# EAGLE schematic Pool Interface (HUZZAH-ESP8266) (EAGLE 7.7.0)
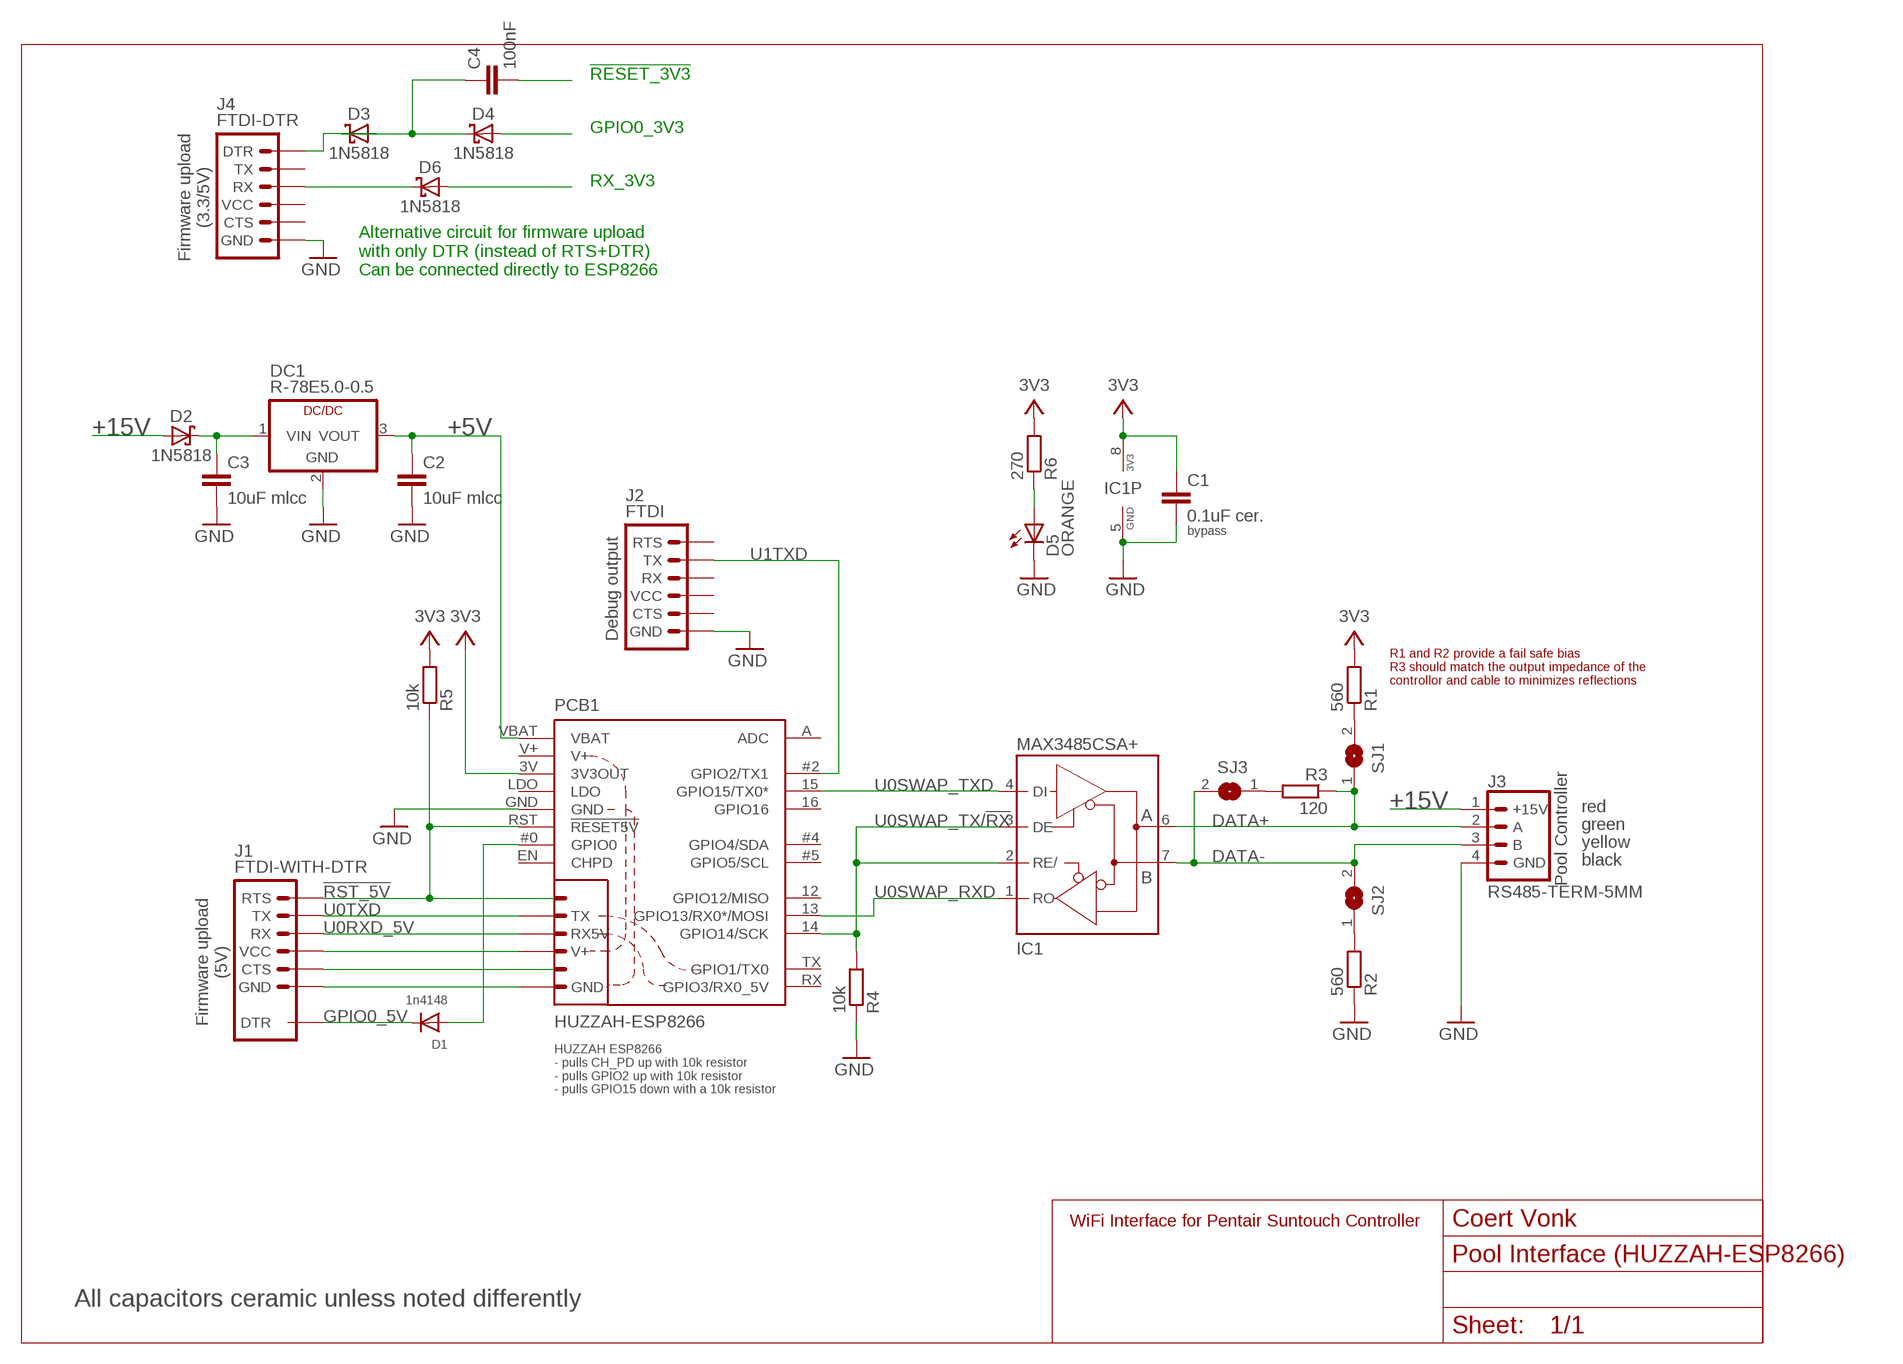
[diagram p0: schematic, sheet 1]
U$1 (FRAME_LETTER_L): AUTHOR_NAME: Coert Vonk; DESCRIPTION: WiFi Interface for Pentair Suntouch Controller; REV: r1.0; URL: http://www.coertvonk.com

## Parts
C1  0.1uF cer.  C-EUC0805K  [C0805K]
C2  10uF mlcc  C-EUC0805K  [C0805K]
C3  10uF mlcc  C-EUC0805K  [C0805K]
C4  100nF  C-EUC0805K  [C0805K]
D1  1n4148  DIODEDO-1N4148  [DO-1N4148]
D2  1N5818  [DO41-7.6]
D3  1N5818  [DO41-7.6]
D4  1N5818  [DO41-7.6]
D5  ORANGE  LEDSML0805  [SML0805]
D6  1N5818  [DO41-7.6]
DC1  R-78E5.0-0.5  [SIP3]
IC1  MAX3485CSA+  [SO08]
J1  FTDI-WITH-DTR  [1X06-DTR]
J2  FTDI  [1X06-DTR]
J3  RS485-TERM-5MM  [RS485-TERM]
J4  FTDI-DTR  [1X06]
PCB1  HUZZAH-ESP8266  [HUZZAH-ESP8266-DUMMY]
R1  560  R-EU_R0805  [R0805]
R2  560  R-EU_R0805  [R0805]
R3  120  R-EU_R0805  [R0805]
R4  10k  R-EU_R0805  [R0805]
R5  10k  R-EU_R0805  [R0805]
R6  270  R-EU_R0805  [R0805]
SJ1  SJ  [SJ]
SJ2  SJ  [SJ]
SJ3  SJ  [SJ]

## Nets
!RST_5V: J1.1(RTS) PCB1.RST(!RESET5V) R5.1
+3V3: C1.1 IC1.8(5V) PCB1.3V(3V3OUT) R1.2 R5.2 R6.2 ; supply symbol labelled 3V3
+5V: C2.1 DC1.3(VOUT) PCB1.VBAT
+15V: C3.1 D2.C DC1.1(VIN) J3.1(+15V)
DATA+: IC1.6(A) J3.2(A) R3.1 SJ1.1
DATA-: IC1.7(B) J3.3(B) SJ2.2 SJ3.2
GND: C1.2 C2.2 C3.2 D5.C DC1.2(GND) IC1.5(GND) J2.6(GND) J3.4(GND) J4.6(GND) PCB1.GND R2.1 R4.1
GPIO0_5V: D1.A PCB1.#0(GPIO0)
N$1: D3.A J4.1(DTR)
N$2: D5.A R6.1
N$3: C4.1 D3.C D4.C
N$4: D6.C J4.3(RX)
N$5: R3.2 SJ3.1
N$6: R2.2 SJ2.1
N$7: R1.1 SJ1.2
N$8: D1.C J1.DTR
N$9: D4.A
N$10: C4.2
N$11: D6.A
N$12: D2.A
N$14: J1.4(VCC) PCB1.V+@2(V+)
N$15: J1.5(CTS)
N$16: J1.6(GND) PCB1.GND@3(GND)
U0RXD_5V: J1.2(RX) PCB1.RX@2(RX5V)
U0SWAP_RXD: IC1.1(RO) PCB1.13(GPIO13/RX0*/MOSI)
U0SWAP_TX/!RX: IC1.2(RE/) IC1.3(DE) PCB1.14(GPIO14/SCK) R4.2
U0SWAP_TXD: IC1.4(DI) PCB1.15(GPIO15/TX0*)
U0TXD: J1.3(TX) PCB1.TX@2(TX)
U1TXD: J2.3(TX) PCB1.#2(GPIO2/TX1)
Unconnected: J2.1(RTS) J2.2(RX) J2.5(CTS) J4.2(TX) J4.5(CTS) PCB1.12(GPIO12/MISO) PCB1.16(GPIO16) PCB1.#4(GPIO4/SDA) PCB1.#5(GPIO5/SCL) PCB1.A(ADC) PCB1.EN(CHPD) PCB1.LDO PCB1.RX(GPIO3/RX0_5V) PCB1.TX(GPIO1/TX0)

## Notes on the sheet
- !RESET_3V3
- GPIO0_3V3
- RX_3V3
- Firmware upload
  (3.3/5V)
- Alternative circuit for firmware upload
  with only DTR (instead of RTS+DTR)
  Can be connected directly to ESP8266
- bypass
- Debug output
- R1 and R2 provide a fail safe bias
  R3 should match the output impedance of the
  controllor and cable to minimizes reflections
- red
- Pool Controller | green
- yellow
- black
- Firmware upload
  (5V)
- HUZZAH ESP8266
  - pulls CH_PD up with 10k resistor
  - pulls GPIO2 up with 10k resistor
  - pulls GPIO15 down with a 10k resistor
- All capacitors ceramic unless noted differently

## Power pins joined to a net without a drawn wire
V+: PCB1.V+
VCC: J2.4(VCC) J4.4(VCC)

## Library data of the parts
C1-C4 = rcl:C-EU: CAPACITOR, European symbol
D1 = adafruit:DIODE: Diode SMADIODE - SMA Surface Mount Package 20V 1A Schottky Diode Digikey: 641-1014-6-ND DO-1N4148 - Through Hole Small Current Diode SOD-123 20V 1 A (.5mV Vf) Schottky Diode - Digikey: MBRX120TPMSCT-ND SOD-323 10V 570mA (.38mV Vf, 3ns) Schottky Diode - Digikey: ZLLS410CT-ND SOD-523 30V 30mA Schottky Diode (RB751S-40TE61) - Digikey: RB751S-40TE61CT-ND SOT23-R/W - SOT23 Package (R = Solder Paste/Reflow Ovens, W = Hand-Soldering) BAT54Film 40V 300mA - Digikey: 497-7162-1-ND
D2-D4 D6 = Coert Vonk:1N581*: 1.0A SCHOTTKY BARRIER RECTIFIER Source: http://www.diodes.com/datasheets/ds23001.pdf
D5 = led:LED: LED OSRAM: - CHIPLED LG R971, LG N971, LY N971, LG Q971, LY Q971, LO R971, LY R971 LH N974, LH R974 LS Q976, LO Q976, LY Q976 LO Q996 - Hyper CHIPLED LW Q18S LB Q993, LB Q99A, LB R99A - SideLED LS A670, LO A670, LY A670, LG A670, LP A670 LB A673, LV A673, LT A673, LW A673 LH A674 LY A675 LS A676, LA A676, LO A676, LY A676, LW A676 LS A679, LY A679, LG A679 - Hyper Micro SIDELED® LS Y876, LA Y876, LO Y876, LY Y876 LT Y87S - SmartLED LW L88C, LW L88S LB L89C, LB L89S, LG L890 LS L89K, LO L89K, LY L89K LS L896, LA L896, LO L896, LY L896 - TOPLED LS T670, LO T670, LY T670, LG T670, LP T670 LSG T670, LSP T670, LSY T670, LOP T670, LYG T670 LG T671, LOG T671, LSG T671 LB T673, LV T673, LT T673, LW T673 LH T674 LS T676, LA T676, LO T676, LY T676, LB T676, LH T676, LSB T676, LW T676 LB T67C, LV T67C, LT T67C, LS T67K, LO T67K, LY T67K, LW E67C LS E67B, LA E67B, LO E67B, LY E67B, LB E67C, LV E67C, LT E67C LW T67C LS T679, LY T679, LG T679 LS T770, LO T770, LY T770, LG T770, LP T770 LB T773, LV T773, LT T773, LW T773 LH T774 LS E675, LA E675, LY E675, LS T675 LS T776, LA T776, LO T776, LY T776, LB T776 LHGB T686 LT T68C, LB T68C - Hyper Mini TOPLED® LB M676 - Mini TOPLED Santana® LG M470 LS M47K, LO M47K, LY M47K Source: http://www.osram.convergy.de LUXEON: - LUMILED® LXK2-PW12-R00, LXK2-PW12-S00, LXK2-PW14-U00, LXK2-PW14-V00 LXK2-PM12-R00, LXK2-PM12-S00, LXK2-PM14-U00 LXK2-PE12-Q00, LXK2-PE12-R00, LXK2-PE12-S00, LXK2-PE14-T00, LXK2-PE14-U00 LXK2-PB12-K00, LXK2-PB12-L00, LXK2-PB12-M00, LXK2-PB14-N00, LXK2-PB14-P00, LXK2-PB14-Q00 LXK2-PR12-L00, LXK2-PR12-M00, LXK2-PR14-Q00, LXK2-PR14-R00 LXK2-PD12-Q00, LXK2-PD12-R00, LXK2-PD12-S00 LXK2-PH12-R00, LXK2-PH12-S00 LXK2-PL12-P00, LXK2-PL12-Q00, LXK2-PL12-R00 Source: www.luxeon.com KINGBRIGHT: KA-3528ASYC Source: www.kingbright.com
DC1 = Coert Vonk:R-78E*-0.5: Recom Power DC/DC-Converter 500 mA SIP3 Single Output Source: Data sheet <http://www.recom-power.com/pdf/Innoline/R-78Exx-0.5.pdf>
IC1 = Coert Vonk:MAX3485CSA+: RS485 TRANSEIVER Datasheet <http://www.mouser.com/ds/2/256/MAX3483-MAX3491-76586.pdf> Order <http://www.mouser.com/Search/ProductDetail.aspx?R=MAX3485CSA%2bvirtualkey66880000virtualkey700-MAX3485CSA>; MF: MAXIM; MPN: MAX481CSA; OC_FARNELL: unknown; OC_NEWARK: 90C3817
J1 = Coert Vonk:FTDI-WITH-DTR: FTDI connector footprints
J2 = Coert Vonk:FTDI: FTDI connector footprints
J3 = Coert Vonk:RS485-TERM: Header 3 Standard 3-pin 0.1" header. Use with straight break away headers (SKU : PRT-00116), right angle break away headers (PRT-00553), swiss pins (PRT-00743), machine pins (PRT-00117), and female headers (PRT-00115). Molex polarized connector foot print use with SKU : PRT-08232 with associated crimp pins and housings.
J4 = Coert Vonk:FTDI-DTR
PCB1 = Coert Vonk:HUZZAH-ESP8266
R1-R6 = rcl:R-EU_: RESISTOR, European symbol
SJ1-SJ3 = jumper:SJ: SMD solder JUMPER